# Altium schematic sheet Buzzer.SchDoc
size A; SheetNumber: 11
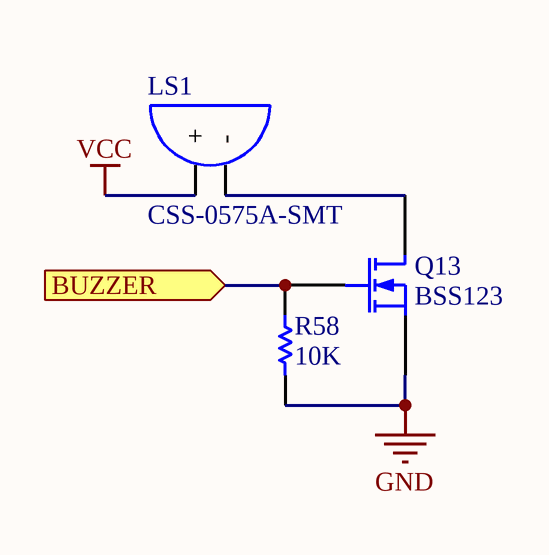
[diagram p0: Buzzer.SchDoc]

## Parts
LS1  CSS-0575A-SMT  [CSS-0575A-SMT]
Q13  BSS123  [SOT323-3]
R58  value 10K  [R0402[1005]]  (hidden comment: 10K 1% 0402)

## Ports
BUZZER (in)

## Nets
GND: Q13.2(S) R58.1
VCC: LS1.1(+)
BUZZER: Q13.1(G) R58.2 ; port BUZZER
NetLS1_2: LS1.2(-) Q13.3(D)

## Library data of the parts
LS1 = CSS-0575A-SMT: Magnetic Buzzer Transducer; Manufacturer: CUI, Inc.; PartNumber: CSS-0575A-SMT; Mounting Technology: Surface Mount; PackageReference: 5x5x1.9mm
Q13 = BSS123WQ-7-F: N-Channel MOSFET; Manufacturer: Diodes Incorporated; PackageReference: SOT-323-3; PartNumber: BSS123WQ-7-F; Mounting Technology: Surface Mount
R58 = RES_10K_0402_1%: 10K 0.063W 1% 0402 (1005 Metric); Manufacturer: KOA Speer; PartNumber: RK73H1ETTP1002F; Tolerance: 1%; Power: 0.063W; Mounting Technology: Surface Mount; PackageReference: 0402; PackageDescription: 0402 (1005 Metric); ComponentLink1Description: Datasheet; ComponentLink1URL: http://www.koaspeer.com/catimages/Products/RK73H/RK73H.pdf